# EAGLE design RH011.1 (EAGLE 7.1.0)
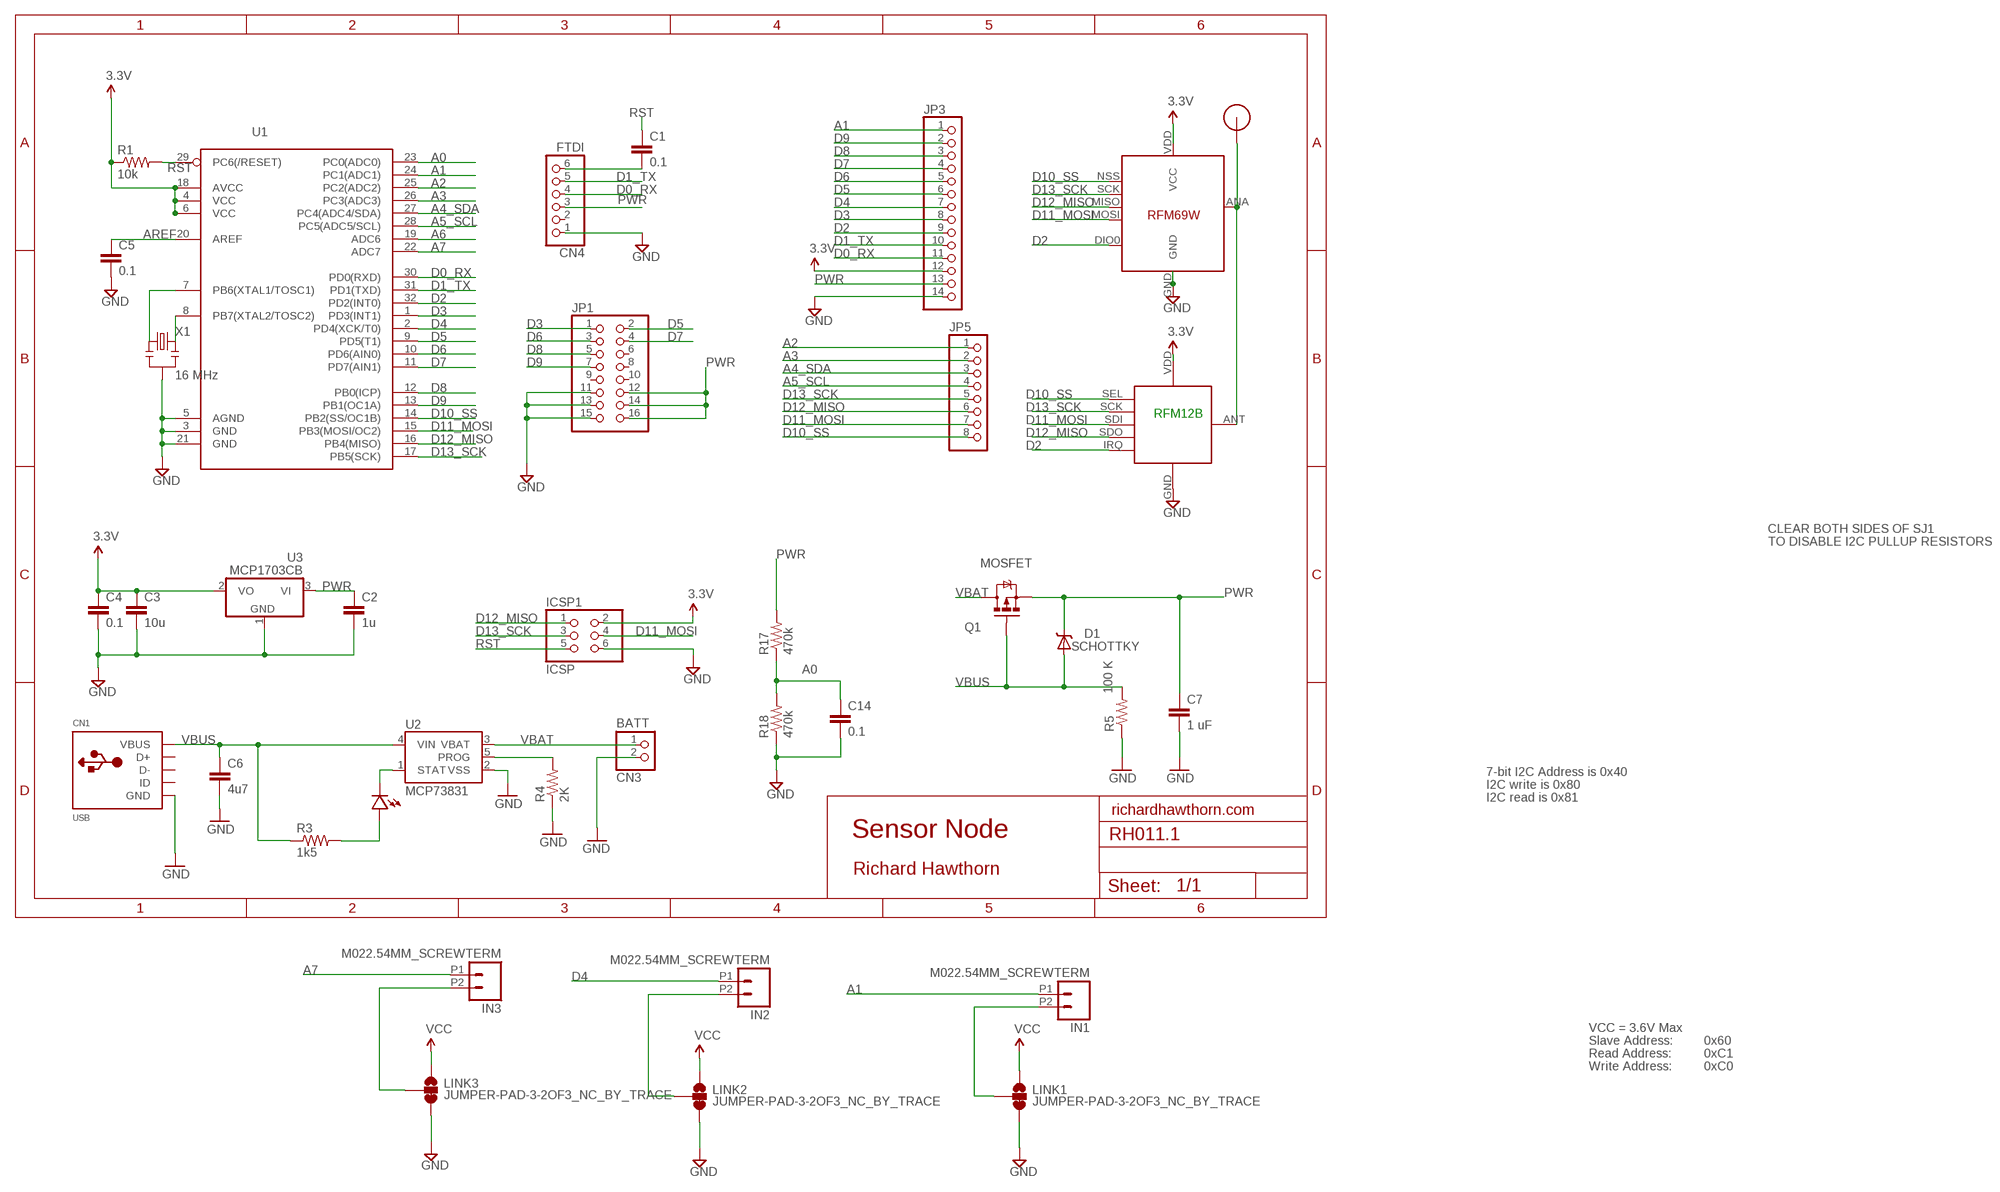
[diagram p0: schematic, sheet 1]

## Parts
C1  0.1  CAP0603-CAP  [0603-CAP]
C2  1u  CAP0603-CAP  [0603-CAP]
C3  10u  CAP0805-CAP  [0805-CAP]
C4  0.1  CAP0603-CAP  [0603-CAP]
C5  0.1  CAP0603-CAP  [0603-CAP]
C6  4u7  CAP0603-CAP  [0603-CAP]
C7  1 uF  CAP0805  [0805]
C14  0.1  CAP0603-CAP  [0603-CAP]
CN1  USB  USBMINIB  [USB-MINIB]
CN3  BATT  JST_2PIN-SMT-RA  [JST-PH-2-SMT-RA]
CN4  FTDI  PINHD-1X6  [1X06]
D1  SCHOTTKY  DIODE-SCHOTTKY_  [SMA-DIODE]
ICSP1  ICSP  PINHD-2X3  [2X03]
IN1  M022.54MM_SCREWTERM  [1X02_2.54_SCREWTERM]
IN2  M022.54MM_SCREWTERM  [1X02_2.54_SCREWTERM]
IN3  M022.54MM_SCREWTERM  [1X02_2.54_SCREWTERM]
JP1  PINHD-2X8  [2X08]
JP3  PINHD-1X14  [1X14]
JP5  PINHD-1X8  [1X08]
LED1  LED0603  [0603-LED]
LINK1  JUMPER-PAD-3-2OF3_NC_BY_TRACE  [PAD-JUMPER-3-2OF3_NC_BY_TRACE_YES_SILK_FULL_BOX]
LINK2  JUMPER-PAD-3-2OF3_NC_BY_TRACE  [PAD-JUMPER-3-2OF3_NC_BY_TRACE_YES_SILK_FULL_BOX]
LINK3  JUMPER-PAD-3-2OF3_NC_BY_TRACE  [PAD-JUMPER-3-2OF3_NC_BY_TRACE_YES_SILK_FULL_BOX]
Q1  MOSFET  MOSFET-PCHANNELSMD  [SOT23-3]
R1  10k  RESISTOR0603-RES  [0603-RES]
R3  1k5  RESISTOR0603-RES  [0603-RES]
R4  2K  RESISTOR0603-RES  [0603-RES]
R5  100 K  RESISTOR0805-RES  [0805]
R17  470k  RESISTOR0603-RES  [0603-RES]
R18  470k  RESISTOR0603-RES  [0603-RES]
RF1  RFM12B  RFM12B_MINPADS  [RFM12B-MINPADS]
RF2  RFM69  [RFM69W-MINPADS]
U1  ATMega-328  ATMEGA168/328TQFP32  [TQFP32-08]
U2  MCP73831  [SOT23-5]
U3  MCP1703CB  [SOT23]
U$1  RFM12B_ANTENNA  [RFM12B-ANTENNA]
X1  16 MHz  RESONATORSMD  [RESONATOR-SMD]

## Nets
3.3V: C3.1 C4.1 ICSP1.2 JP3.12 LINK1.1 LINK2.1 LINK3.1 R1.1 RF1.VDD RF2.VDD(VCC) U1.4(VCC) U1.6(VCC) U1.18(AVCC) U3.2(VO) ; supply symbol labelled VCC
A0: C14.1 R17.1 R18.2 U1.23(PC0(ADC0))
A1: IN1.P1 JP3.1 U1.24(PC1(ADC1))
A2: JP5.1 U1.25(PC2(ADC2))
A3: JP5.2 U1.26(PC3(ADC3))
A4_SDA: JP5.3 U1.27(PC4(ADC4/SDA))
A5_SCL: JP5.4 U1.28(PC5(ADC5/SCL))
A6: U1.19(ADC6)
A7: IN3.P1 U1.22(ADC7)
AREF: C5.1 U1.20(AREF)
D0_RX: CN4.4 JP3.11 U1.30(PD0(RXD))
D1_TX: CN4.5 JP3.10 U1.31(PD1(TXD))
D2: JP3.9 RF1.IRQ RF2.DIO0 U1.32(PD2(INT0))
D3: JP1.1 JP3.8 U1.1(PD3(INT1))
D4: IN2.P1 JP3.7 U1.2(PD4(XCK/T0))
D5: JP1.2 JP3.6 U1.9(PD5(T1))
D6: JP1.3 JP3.5 U1.10(PD6(AIN0))
D7: JP1.4 JP3.4 U1.11(PD7(AIN1))
D8: JP1.5 JP3.3 U1.12(PB0(ICP))
D9: JP1.7 JP3.2 U1.13(PB1(OC1A))
D10_SS: JP5.8 RF1.SEL RF2.NSS(SEL) U1.14(PB2(SS/OC1B))
D11_MOSI: ICSP1.4 JP5.7 RF1.SDI(SDI/MOSI) RF2.MOSI U1.15(PB3(MOSI/OC2))
D12_MISO: ICSP1.1 JP5.6 RF1.SDO(SDO/MISO) RF2.MISO U1.16(PB4(MISO))
D13_SCK: ICSP1.3 JP5.5 RF1.SCK RF2.SCK U1.17(PB5(SCK))
GND [power]: C2.2 C3.2 C4.2 C5.2 C6.2 C7.2 C14.2 CN1.GND CN3.2 CN4.1 ICSP1.6 JP1.11 JP1.13 JP1.15 JP3.14 LINK1.3 LINK2.3 LINK3.3 R4.1 R5.1 R18.1 RF1.GND RF2.GND U1.3(GND) U1.5(AGND) U1.21(GND) U2.2(VSS) U3.1(GND) X1.2
N$1: U1.7(PB6(XTAL1/TOSC1)) X1.1
N$3: RF1.ANT RF2.ANA(ANT) U$1.P$1
N$4: LED1.PLUS R3.2
N$13 [power]: IN1.P2 LINK1.2
N$15 [power]: IN2.P2 LINK2.2
N$19 [power]: IN3.P2 LINK3.2
N$20: C1.2 CN4.6
N$21: U1.8(PB7(XTAL2/TOSC2)) X1.3
PROG: R4.2 U2.5(PROG)
PWR [power]: C2.1 C7.1 CN4.3 D1.C JP1.12 JP1.14 JP1.16 JP3.13 Q1.2(S) R17.2 U3.3(VI)
RST: C1.1 ICSP1.5 R1.2 U1.29(PC6(/RESET))
STAT: LED1.MINUS U2.1(STAT)
VBAT: CN3.1 Q1.3(D) U2.3(VBAT)
VBUS [power]: C6.1 CN1.VBUS D1.A Q1.1(G) R3.1 R5.2 U2.4(VIN)
Unconnected: CN1.D+ CN1.D- CN1.ID CN4.2 JP1.6 JP1.8 JP1.9 JP1.10

## Notes on the sheet
- RFM12B
- CLEAR BOTH SIDES OF SJ1
- TO DISABLE I2C PULLUP RESISTORS
- 7-bit I2C Address is 0x40
- I2C write is 0x80
- I2C read is 0x81
- richardhawthorn.com
- Sensor Node
- Richard Hawthorn
- VCC = 3.6V Max
- Slave Address: | 0x60
- Read Address: | 0xC1
- Write Address: | 0xC0

## Library data of the parts
C1-C5 C14 = LowPowerLab:CAP: Capacitor Standard 0603 ceramic capacitor, and 0.1" leaded capacitor.
C6 = SparkFun:CAP: Capacitor Standard 0603 ceramic capacitor, and 0.1" leaded capacitor.
C7 = SparkFun-Capacitors:CAP: Capacitor Standard 0603 ceramic capacitor, and 0.1" leaded capacitor.
CN1 = LowPowerLab:USB: USB Connectors USBMINIB - Surface Mount Female Mini-B USB Connector 4UConnector: 06564 By microbuilder.eu Thru-hole RA Female Mini-B USB Connector 4UConnector: 18732 By ladyada.net
CN3 = adafruit:JST_2PIN: JST 2-Pin Connectors of various flavors SMT-RA (S2B-PH-SM4) 4UConnector #17311 SMT (B2B-PH-SM4) THM-RA (S2B-PH) THM (B2B-PH)
CN4 = pinhead:PINHD-1X6: PIN HEADER
D1 = SparkFun-DiscreteSemi:DIODE-SCHOTTKY: Commonly MBRA140.
ICSP1 = pinhead:PINHD-2X3: PIN HEADER
IN1-IN3 = SparkFun-Connectors:M02: Standard 2-pin 0.1" header. Use with - straight break away headers ( PRT-00116) - right angle break away headers (PRT-00553) - swiss pins (PRT-00743) - machine pins (PRT-00117) - female headers (PRT-00115) Molex polarized connector foot print use with: PRT-08233 with associated crimp pins and housings. 2.54_SCREWTERM for use with PRT-10571. 3.5mm Screw Terminal footprints for PRT-08084 5mm Screw Terminal footprints for use with PRT-08432
JP1 = pinhead:PINHD-2X8: PIN HEADER
JP3 = pinhead:PINHD-1X14: PIN HEADER
JP5 = pinhead:PINHD-1X8: PIN HEADER
LED1 = LowPowerLab:LED
LINK1-LINK3 = SparkFun-Passives:JUMPER-PAD-3-2OF3_NC_BY_TRACE
Q1 = SparkFun-DiscreteSemi:MOSFET-PCHANNEL: Generic PMOSFET
R1 R3 R4 R17 R18 = LowPowerLab:RESISTOR: Resistor Basic schematic elements and footprints for 0603, 1206, and PTH resistors.
R5 = SparkFun-Resistors:RESISTOR: Resistor Basic schematic elements and footprints for 0603, 1206, and PTH resistors.
RF1 = LowPowerLab:RFM12B_MINPADS
RF2 = LowPowerLab:RFM69
U1 = LowPowerLab:ATMEGA168/328: Atmel 32-pin 8-bit micro, 16k flash.
U2 = SparkFun:MCP73831: Microchip's MCP73831 Miniature single cell, fully integrated Li-Ion, Li-polymer charge management controller http://ww1.microchip.com/downloads/en/DeviceDoc/21984a.pdf
U3 = linear:MCP1703: 250 mA, 16V, Low Quiescent Current LDO Regulator Source: http://ww1.microchip.com/downloads/en/DeviceDoc/22049b.pdf
U$1 = LowPowerLab:RFM12B_ANTENNA
X1 = SparkFun:RESONATOR: Resonator Small SMD resonator. This is the itty bitty 10/20MHz resonators with built in caps. CSTCE10M0G55 and CSTCE20M0V53. Footprint has been reviewed closely but hasn't been tested yet.

## Net classes
1 power: width 0.381 mm, clearance 0.254 mm

## Board
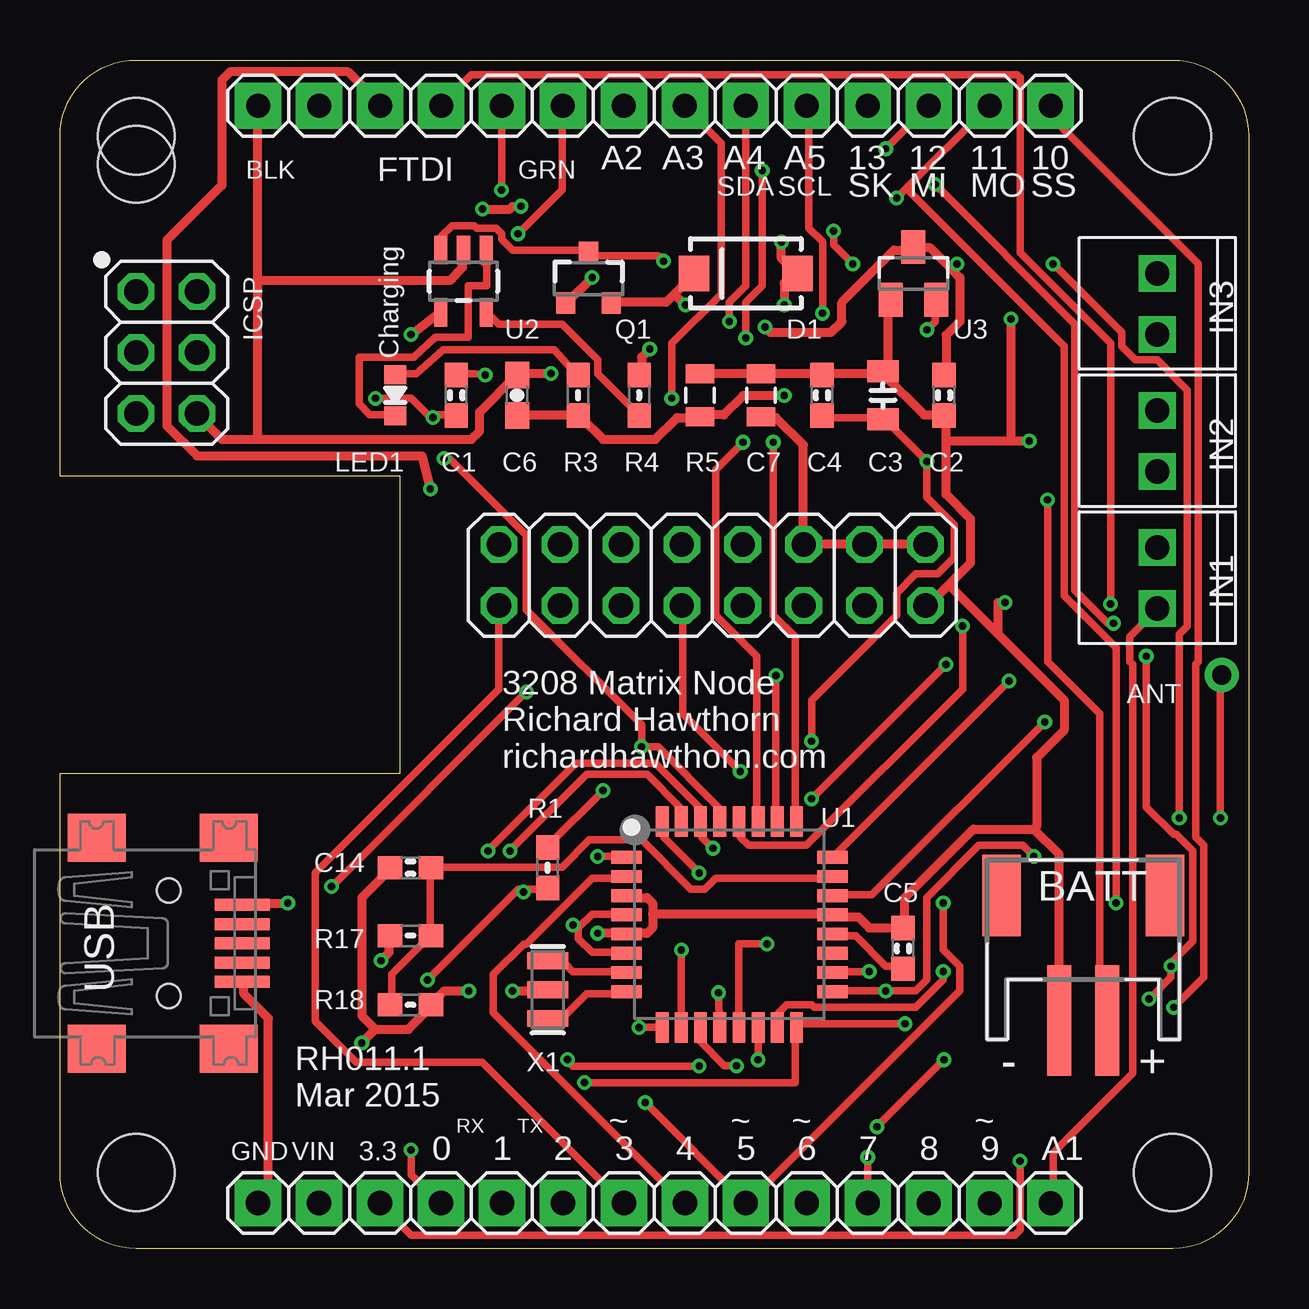
[diagram p1: board, top side]
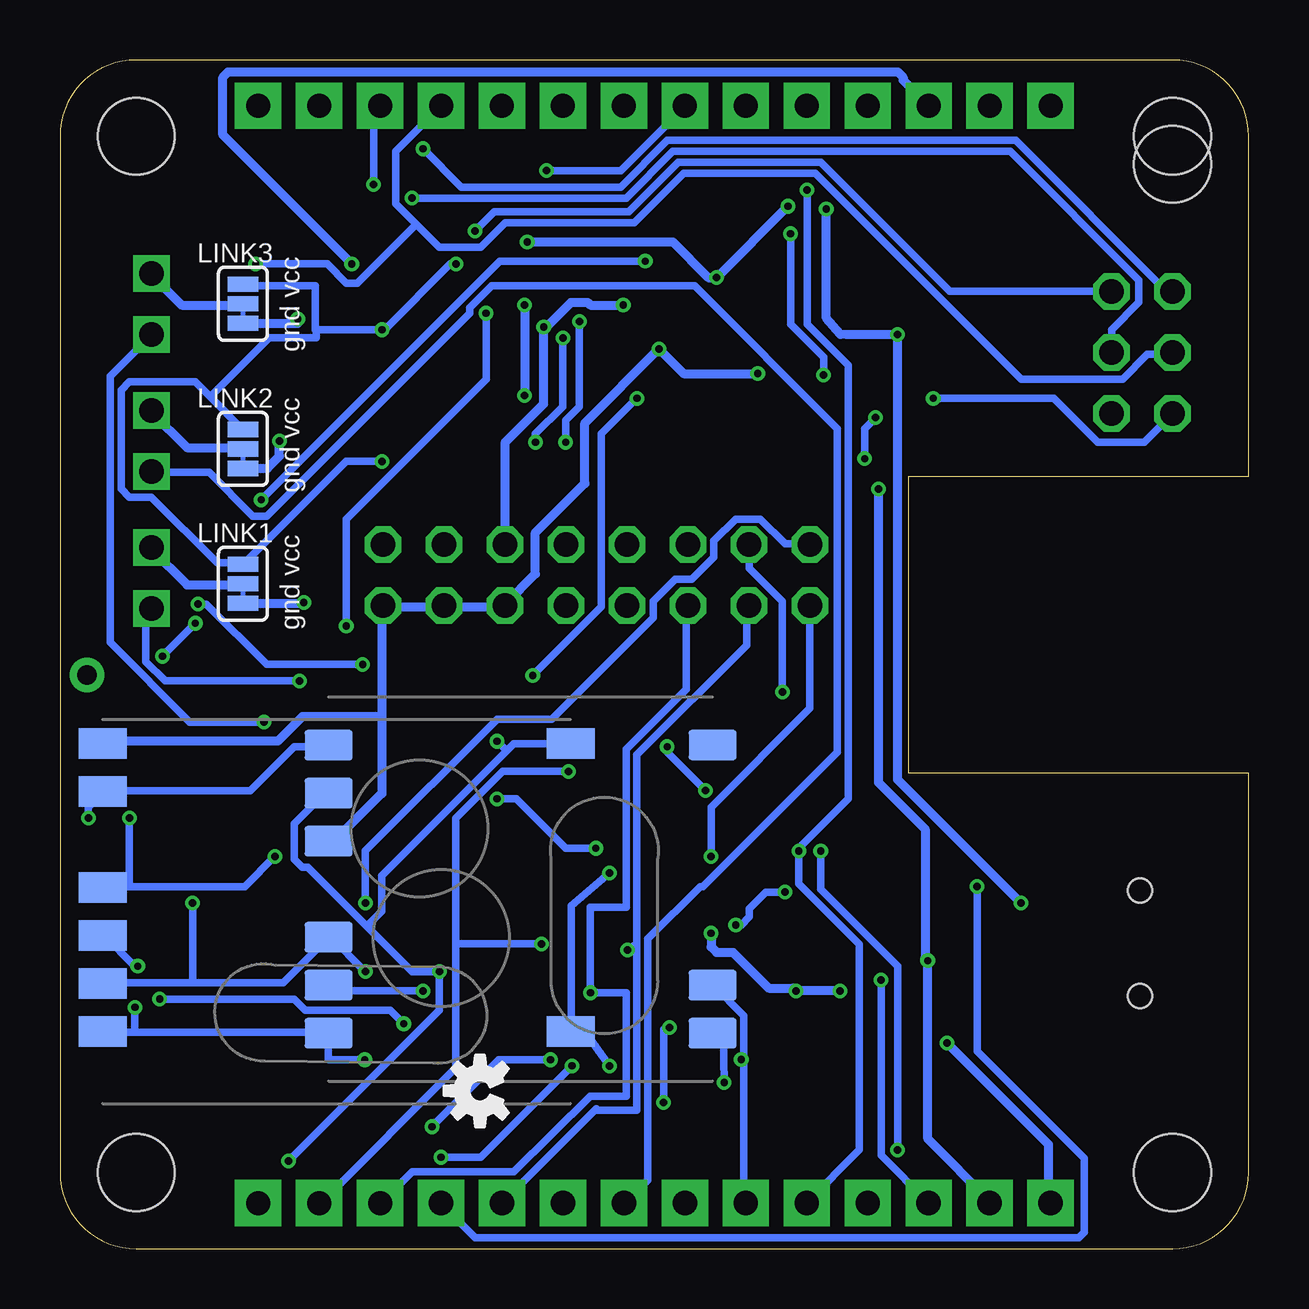
[diagram p2: board, bottom side, seen from below]

Size 49.53 x 49.53 mm. Coordinates in mm from the lower left corner, seen from the top.
Outline: 0,3.17 0,19.81 14.17,19.81 14.17,32.18 0,32.18 0,46.35 arc-90 3.17,49.53 46.35,49.53 arc-90 49.53,46.35 49.53,3.17 arc-90 46.35,0 3.17,0 arc-90 0,3.17
Copper layers (1*16): Top 0.035mm / dielectric 1.5mm / Bottom 0.035mm
Design rules "ITEADstudio_DRC *": minimum track width 12mil, minimum drill 12mil, track to track 6mil, track to pad 6mil, pad to pad 6mil, via to via 6mil, smd to smd 0mil, copper to edge 10mil, drill to drill 10mil, minimum pad ring 10mil, minimum via ring 6mil, stop-mask expansion 2mil, vias tented up to drill 100mil, thermal gap 15mil
Holes 3.2 mm at 3.17,3.17 46.35,3.17 3.17,46.35 46.35,46.35 3.17,45.19
tKeepout: area 0,0 to 5.7,5.7; area 43.8,0 to 49.5,5.7; area 43.8,43.8 to 49.5,49.5; area 0,43.8 to 5.7,49.5
bKeepout: area 0,43.8 to 5.7,49.5; area 43.8,43.8 to 49.5,49.5; area 43.8,0 to 49.5,5.7; area 0,0 to 5.7,5.7
tRestrict: area 24.3,8.9 to 29.1,12.8; area 5.8,16.9 to 6.9,18.5; area 5.2,9.7 to 6.7,10.4
bRestrict: area 27.4,17.7 to 29.2,18.7; area 21.1,13.8 to 22.9,14.9; area 21.6,12.6 to 22.1,13.2; area 20.7,12.6 to 21.2,13.2; area 20.2,12.8 to 20.7,13.5; area 20.1,13.4 to 20.6,14; area 26.5,18.9 to 27.1,19.5; area 26.5,17.9 to 27.1,18.5; area 27.5,19.1 to 28,19.8; area 27.9,18.8 to 29.1,19.6

### Footprints (pad centres in the part's own frame; a part is rotated, then mirrored left to right if it is on the bottom)
0603-CAP = smd 1.016 x 0.965: 1 -0.85,0; 2 0.85,0
0805-CAP = smd 0.902 x 1.3: 1 -1,0; 2 1,0
0603-CAP' = smd 1.1 x 1: 1 -0.85,0; 2 0.85,0
0805 = smd 0.8 x 1.2: 1 -0.9,0; 2 0.9,0
USB-MINIB = smd 0.5 x 2.308: D+ 0,4.064; D- -0.8,4.064; GND 1.6,4.064; ID 0.8,4.064; VBUS -1.6,4.064 | smd 2 x 2.4: GND1 -4.4,-2; GND2 -4.4,3.5; GND3 4.4,3.5; GND4 4.4,-2 | hole 1: -2.2,1; 2.2,1
JST-PH-2-SMT-RA = smd 1 x 4.6: 1 1,-3.7; 2 -1,-3.7 | smd 1.6 x 3.4: NC1 -3.4,1.5; NC2 3.4,1.5
1X06 = drill 1 pad 1.93 square: 1 -6.35,0; 2 -3.81,0; 3 -1.27,0; 4 1.27,0; 5 3.81,0; 6 6.35,0
SMA-DIODE = smd 1.27 x 1.47: A -2.15,0; C 2.15,0
2X03 = drill 1.016 octagon: 1 -2.54,-1.27; 2 -2.54,1.27; 3 0,-1.27; 4 0,1.27; 5 2.54,-1.27; 6 2.54,1.27
1X02_2.54_SCREWTERM = drill 1.016 square: P1 2.54,0; P2 0,0
2X08 = drill 1.016 octagon: 1 -8.89,-1.27; 2 -8.89,1.27; 3 -6.35,-1.27; 4 -6.35,1.27; 5 -3.81,-1.27; 6 -3.81,1.27; 7 -1.27,-1.27; 8 -1.27,1.27; 9 1.27,-1.27; 10 1.27,1.27; 11 3.81,-1.27; 12 3.81,1.27; 13 6.35,-1.27; 14 6.35,1.27; 15 8.89,-1.27; 16 8.89,1.27
1X14 = drill 1 pad 1.93 square: 1 -16.51,0; 2 -13.97,0; 3 -11.43,0 | drill 1.016 pad 1.93 square: 4 -8.89,0; 5 -6.35,0; 6 -3.81,0; 7 -1.27,0; 8 1.27,0; 9 3.81,0; 10 6.35,0; 11 8.89,0; 12 11.43,0; 13 13.97,0; 14 16.51,0
1X08 = drill 1 pad 1.93 square: 1 -8.89,0; 2 -6.35,0; 3 -3.81,0; 4 -1.27,0; 5 1.27,0; 6 3.81,0; 7 6.35,0; 8 8.89,0
0603-LED = smd 0.8 x 0.9: MINUS -0.85,0; PLUS 0.85,0
PAD-JUMPER-3-2OF3_NC_BY_TRACE_YES_SILK_FULL_BOX = smd 0.635 x 1.27: 1 -0.813,0; 2 0,0; 3 0.813,0
SOT23-3 = smd 0.8 x 0.9: 1 -0.95,-1; 2 0.95,-1; 3 0,1.1
0603-RES = smd 1.016 x 0.965: 1 -0.85,0; 2 0.85,0
RFM12B-MINPADS = smd 2 x 1.27: ANT 8,-6; GND 8,-2; IRQ -8,4; SCK 8,4; SDI 8,2; SDI1 -8.002,-6.001; SDO -8,6; SEL 8,6; VDD 8,-4
RFM69W-MINPADS = smd 2 x 1.27: ANA 8,-5; DIO0 -11.5,5; GND 8,-7; MISO 8,1; MOSI 8,3; NSS 8,5; SCK 8,-1; VDD -11.5,-7
TQFP32-08 = smd 1.27 x 0.533: 1 -4.293,2.8; 2 -4.293,2; 3 -4.293,1.2; 4 -4.293,0.4; 5 -4.293,-0.4; 6 -4.293,-1.2; 7 -4.293,-2; 8 -4.293,-2.8; 17 4.293,-2.8; 18 4.293,-2; 19 4.293,-1.2; 20 4.293,-0.4; 21 4.293,0.4; 22 4.293,1.2; 23 4.293,2; 24 4.293,2.8 | smd 0.533 x 1.27: 9 -2.8,-4.293; 10 -2,-4.293; 11 -1.2,-4.293; 12 -0.4,-4.293; 13 0.4,-4.293; 14 1.2,-4.293; 15 2,-4.293; 16 2.8,-4.293; 25 2.8,4.293; 26 2,4.293; 27 1.2,4.293; 28 0.4,4.293; 29 -0.4,4.293; 30 -1.2,4.293; 31 -2,4.293; 32 -2.8,4.293
SOT23-5 = smd 0.55 x 1.2: 1 -0.95,-1.3; 2 0,-1.3; 3 0.95,-1.3; 4 0.95,1.3; 5 -0.95,1.3
SOT23 = smd 1 x 1.4: 1 -0.95,-1.1; 2 0.95,-1.1; 3 0,1.1
RFM12B-ANTENNA = drill 0.8 pad 1.422: P$1 0,0
RESONATOR-SMD = smd 0.7 x 1.7: 1 -1.2,0; 2 0,0; 3 1.2,0

### Placement (x,y rotation side)
C1  16.51,35.56 90 top
C2  36.83,35.56 270 top
C3  34.29,35.56 90 top
C4  31.75,35.56 90 top
C5  35.13,12.52 90 top
C6  4u7  [0603-CAP']  19.05,35.56 90 top
C7  29.21,35.56 90 top
C14  14.61,15.88 180 top
CN1  3.53,12.73 270 top
CN3  42.64,13.22 0 top
CN4  14.61,47.62 0 top
D1  28.57,40.64 180 top
ICSP1  4.45,37.34 270 top
IN1  45.72,29.21 270 top
IN2  45.72,34.92 270 top
IN3  45.72,40.64 270 top
JP1  27.18,28.07 0 top
JP3  24.77,1.91 180 top
JP5  32.38,47.62 0 top
LED1  13.97,35.56 90 top
LINK1  41.91,27.71 270 bottom
LINK2  41.91,33.33 270 bottom
LINK3  41.91,39.37 270 bottom
Q1  22.02,40.41 0 top
R1  20.32,15.88 90 top
R3  21.59,35.56 90 top
R4  24.13,35.56 270 top
R5  26.67,35.56 270 top
R17  14.61,13.04 180 top
R18  14.61,10.16 180 top
RF1  30.34,14.99 180 bottom
RF2  39.75,14.05 180 bottom
U1  27.89,13.51 0 top
U2  16.81,40.31 180 top
U3  35.56,40.64 0 top
U$1  48.41,23.91 0 top
U$3  [OSHW-LOGO-S]  32.03,6.58 90 bottom
X1  20.32,10.79 270 top

### Tracks (layer width: path | path; a pad name or v marks a point on that pad's centre or on a via)
3.3V  (via drill 0.3)
  Top 0.305: 21.6,13.37 21.6,12.92 22.17,12.34 23.55,12.34 U1.6 | 21.6,13.37 22.17,13.95 23.55,13.95 U1.4 | 19.32,14.97 19.09,14.97 v15.32,11.2 | 19.32,14.97 20.23,14.97 R1.1 | v21.37,13.49 21.49,13.37 21.6,13.37 | v19.32,14.86 19.32,14.97 | v33.72,11.54 32.23,11.54 U1.18 | C4.1 31.77,34.63 34.29,34.63 C3.1 34.4,34.52 v36.12,32.8 36.12,31.32 37.26,30.18 37.26,28.8 36.58,28.12 35.66,28.12 34.86,27.32 34.86,26.4 31.32,22.86 v31.32,21.14 | v36.12,38.29 36.46,38.63 36.46,39.43 U3.2 | v32.23,42.41 32.23,41.83 v33.03,41.03 | v40.01,3.66 40.01,0.8 39.78,0.57 14.63,0.57 13.37,1.83 JP3.12
  Bottom 0.305: v15.32,11.2 15.32,3.89 JP3.12 | v21.37,13.49 21.14,13.49 20.8,13.83 20.8,14.17 20.12,14.86 v19.32,14.86 | 28.23,21.03 RF2.VDD 28.35,21.03 30.63,21.03 30.92,20.75 | 36.75,13.43 39.2,15.89 39.43,15.89 39.78,16.23 39.78,17.72 38.41,19.09 RF1.VDD | 36.75,13.43 34.86,11.54 v33.72,11.54 33.72,9.94 v40.01,3.66 | 30.92,20.75 36.12,15.54 36.12,14.06 36.75,13.43 | 43.26,35.49 41.95,34.18 LINK2.1 | 43.26,35.49 43.89,36.12 46.63,36.12 46.98,35.78 46.98,31.66 46.63,31.32 45.72,31.32 42.98,28.57 41.95,28.57 LINK1.1 41.83,28.57 37.6,32.8 v36.12,32.8 | 38.86,38.29 38.86,37.95 40.8,37.95 43.26,35.49 | 38.86,38.29 38.9,38.29 38.9,40.12 41.83,40.12 LINK3.1 | 38.86,38.29 v36.12,38.29 36.01,38.29 33.26,41.03 v33.03,41.03 | v32.23,42.41 31.43,43.2 25.83,43.2 23.77,45.26 17.83,45.26 12.46,39.89 ICSP1.2 | v31.32,21.14 30.92,20.75
A0
  Top 0.305: R18.2 13.83,10.17 13.83,11.43 15.43,13.03 R17.1 15.43,13.14 15.43,15.77 C14.1 15.54,15.89 20.92,15.89 22.06,17.03 24.23,17.03 26.29,14.97 26.86,14.97 27.32,15.43 32.12,15.43 U1.23
A1  (via drill 0.3)
  Top 0.305: v39.55,23.66 32.23,16.34 U1.24 | JP3.1 41.38,1.94 41.38,4 44.69,7.32 44.69,24.35 44.58,24.46 44.58,25.49 45.72,26.63 IN1.P1
  Bottom 0.305: v39.55,23.66 45.15,23.66 45.95,24.46 45.95,26.4 45.72,26.63 IN1.P1
A2  (via drill 0.3)
  Top 0.305: v29.72,33.6 29.72,26.4 30.63,25.49 30.63,17.83 U1.25 | v28.57,37.95 28.57,39.43 29.26,40.12 v29.26,44.92
  Bottom 0.305: v29.72,33.6 29.72,33.95 28.57,35.09 v28.57,37.95 | v29.26,44.92 26.18,44.92 23.55,47.55 JP5.1
A3  (via drill 0.3)
  Top 0.305: v29.83,23.89 29.83,17.83 U1.26 | v25.49,35.43 25.49,37.72 27.55,39.78 27.55,46.06 26.06,47.55 JP5.2
  Bottom 0.305: v29.83,23.89 26.98,26.75 26.98,33.95 v25.49,35.43
A4_SDA  (via drill 0.3)
  Top 0.305: v28.46,33.6 27.32,32.46 27.32,26.4 29.03,24.69 29.03,17.83 U1.27 | v27.89,38.63 27.89,39.43 28.57,40.12 JP5.3
  Bottom 0.305: v28.46,33.6 28.46,34.52 27.89,35.09 v27.89,38.63
A5_SCL  (via drill 0.3)
  Top 0.305: v37.6,25.95 37.6,23.32 31.09,16.8 28.69,16.8 28.35,17.14 28.35,17.72 U1.28 | v31.77,38.98 31.77,41.95 31.2,42.52 31.2,47.55 JP5.4
  Bottom 0.305: v37.6,25.95 37.6,30.4 31.77,36.23 v31.77,38.98
A7  (via drill 0.3)
  Top 0.305: v41.03,21.95 33.83,14.74 32.23,14.74 U1.22
  Bottom 0.305: v41.03,21.95 44.12,21.95 47.43,25.26 47.43,36.35 45.72,38.06 IN3.P1
AREF
  Top 0.305: C5.1 35.09,11.77 34.4,11.77 33.15,13.03 32.23,13.03 U1.20
D0_RX  (via drill 0.3)
  Top 0.305: v17.83,16.57 21.49,20.23 24.8,20.23 26.63,18.4 26.63,17.83 U1.30 26.75,17.72 26.75,17.14 v27.2,16.69 | v14.63,4.12 14.63,3.09 15.77,1.94 JP3.11 | v43.78,26.86 43.78,37.72 40.01,41.49 40.01,48.81 39.89,48.92 17.14,48.92 15.89,47.66 CN4.4 | v31.32,18.75 v36.92,24.35
  Bottom 0.305: v17.83,16.57 17.83,14.97 14.63,11.77 v14.63,4.12 | v43.78,26.86 43.43,26.86 40.92,24.35 v36.92,24.35 | v31.32,18.75 30.52,18.75 28.46,16.69 v27.2,16.69
D1_TX  (via drill 0.3)
  Top 0.305: v18.75,16.57 21.95,19.77 24.46,19.77 25.83,18.4 25.83,17.83 U1.31 | v18.4,44.12 18.4,47.55 CN4.5
  Bottom 0.305: JP3.10 18.4,1.94 16.23,4.12 16.23,12.69 18.75,15.2 v18.75,16.57 18.75,16.69 16.69,18.75 16.69,36.8 18.4,38.52 v18.4,44.12
D2  (via drill 0.3)
  Top 0.305: v26.63,15.66 25.15,17.14 25.15,17.72 U1.32 | v26.63,7.61 21.37,7.61 v21.14,7.89
  Bottom 0.305: v26.63,15.66 28.23,14.3 28.23,9.14 RF2.DIO0 27.89,9.37 v26.63,7.61 | 21.03,7.89 21.03,1.94 JP3.9 | 21.03,7.89 21.03,9.72 22.29,10.97 RF1.IRQ | v21.14,7.89 21.03,7.89
D3  (via drill 0.3)
  Top 0.305: v22.4,16.34 23.55,16.34 U1.1 | JP1.1 18.29,23.32 10.63,15.66 10.63,9.49 12.34,7.77 17.6,7.77 23.43,1.94 JP3.8
  Bottom 0.305: v22.4,16.34 22.4,18.4 18.29,22.52 JP1.1
D4
  Top 0.305: U1.2 23.55,15.43 22.17,15.43 19.43,12.69 19.32,12.69 18.06,11.43 18.06,9.83 25.95,1.94 JP3.7
  Bottom 0.305: IN2.P1 45.72,32.35 43.32,32.35 41.49,30.52 40.92,30.52 32.46,38.98 32.46,39.2 31.55,40.12 23.09,40.12 17.14,34.18 17.14,20.69 22.75,15.09 22.86,15.09 25.03,12.92 25.03,2.86 25.95,1.94 JP3.7
D5  (via drill 0.3)
  Top 0.305: v36.8,14.4 36.8,12.46 37.49,11.77 37.49,10.74 28.57,1.83 JP3.6 v24.38,6.1 | v24.13,9.22 U1.9
  Bottom 0.305: v36.8,14.4 36.8,16.57 31.32,22.06 29.03,22.06 24.8,26.29 24.8,26.98 23.89,27.89 23.2,27.89 22.29,28.8 22.29,29.49 21.37,30.4 20.34,30.4 19.32,29.38 18.29,29.38 JP1.2 | v24.38,6.1 24.38,9.14 v24.13,9.22
D6  (via drill 0.3)
  Top 0.305: U1.10 v25.89,12.45
  Bottom 0.305: 25.49,12.7 25.49,5.77 27.18,5.77 27.18,5.84 31.09,1.94 JP3.5 | 25.49,12.7 25.49,20.57 20.92,25.15 20.92,26.75 JP1.3 | v25.89,12.45 25.49,12.7
D7  (via drill 0.3)
  Top 0.305: v11.32,15.09 v19.43,23.2 | U1.11 26.67,8.64 27.69,7.62 v28.19,7.62 | v33.66,3.81 JP3.4
  Bottom 0.305: v19.43,23.2 19.43,26.98 20.8,28.35 20.8,29.26 JP1.4 | v11.32,15.09 11.32,8.23 6.86,3.77 6.86,0.69 7.09,0.46 32.23,0.46 33.6,1.83 JP3.4 | v28.19,7.62 32,3.81 v33.66,3.81
D8  (via drill 0.3)
  Top 0.305: U1.12 v27.43,10.67
  Bottom 0.305: JP1.5 23.43,26.75 23.43,23.32 25.95,20.8 25.95,14.22 27.43,14.22 v27.43,10.67 25.95,10.67 25.95,6.36 27.43,6.36 27.43,6.35 30.63,3.2 34.86,3.2 36.12,1.94 JP3.3
D9  (via drill 0.3)
  Top 0.305: v28.35,19.89 25.95,22.29 25.95,26.75 JP1.7 | U1.13 28.29,12.7 v29.46,12.7
  Bottom 0.305: v28.35,19.89 31.09,19.89 33.03,17.95 33.03,12.7 | 33.03,12.7 33.03,7.54 38.63,1.94 JP3.2 | v29.46,12.7 33.03,12.7
D10_SS  (via drill 0.3)
  Top 0.305: v46.41,10.06 47.66,11.32 47.66,16.8 47.32,17.14 47.32,24.35 47.43,24.46 47.43,41.03 41.38,47.09 41.38,47.55 JP5.8 | U1.14 v29.09,7.87 | v34.04,5.08 v36.83,7.87
  Bottom 0.305: 46.41,9.03 47.66,9.03 RF2.NSS | 46.41,9.03 38.41,9.03 RF1.SEL 38.35,7.87 v36.83,7.87 | 46.41,9.03 v46.41,10.06 | v29.09,7.87 31.24,7.87 v34.04,5.08
D11_MOSI  (via drill 0.3)
  Top 0.305: v36.8,11.54 36.8,11.2 35.66,10.06 31.43,10.06 31.32,10.17 30.29,10.17 29.95,9.83 29.95,9.26 U1.15 | 35.26,44.18 38.63,47.55 JP5.7 | 35.26,44.18 v34.86,43.78 | v44.01,14.4 44.01,25.03 41.83,27.2 41.83,37.6 35.26,44.18
  Bottom 0.305: v36.8,11.54 38.29,13.03 RF1.SDI 38.41,12.92 40.23,11.09 44.01,11.09 | 44.01,11.09 47.66,11.09 RF2.MOSI | ICSP1.4 5.71,38.29 4.57,39.43 4.57,40.35 9.94,45.72 24,45.72 25.95,43.78 v34.86,43.78 | v44.01,14.4 44.01,11.09
D12_MISO  (via drill 0.3)
  Top 0.305: v21.86,6.92 30.63,6.92 30.63,9.14 U1.16 30.75,9.26 30.86,9.37 v35.2,9.37 | v45.38,10.4 46.29,11.32 v46.29,11.77 46.29,11.89 47.21,12.8 47.21,16.57 46.52,17.26 46.41,17.26 45.26,18.4 v45.26,24.69 | JP5.6 v34.4,45.83 | v43.89,26.06 43.66,26.06 42.29,27.43 42.29,38.52 v36.46,44.35
  Bottom 0.305: v21.86,6.92 21.89,8.91 RF1.SDO | v46.29,11.77 46.41,11.77 47.66,13.03 RF2.MISO | v45.38,10.4 39.78,10.4 39.32,9.94 35.78,9.94 v35.2,9.37 | v34.4,45.83 32.8,44.23 26.18,44.23 24.23,46.18 9.72,46.18 3.43,39.89 3.2,39.89 ICSP1.1 | v43.89,26.06 v45.26,24.69 | v36.46,44.35 36.46,47.32 36.23,47.55 JP5.6
D13_SCK  (via drill 0.3)
  Top 0.305: U1.17 32.23,10.74 v34.4,10.74 35.66,10.74 36.12,11.2 36.12,14.63 38.29,16.8 40.12,16.8 v40.58,16.34 | v46.63,17.95 46.63,25.6 46.98,25.95 46.98,35.78 45.72,37.03 44.81,37.03 44.23,37.6 44.23,38.18 v41.38,41.03
  Bottom 0.305: v34.4,10.74 38.06,10.74 38.29,10.97 RF1.SCK | 46.63,15.09 41.83,15.09 v40.58,16.34 | 46.63,15.09 47.66,15.09 RF2.SCK | 34.69,42.69 35.55,43.55 35.55,45.72 33.72,47.55 JP5.5 | 34.69,42.69 33.72,41.72 32,41.72 30.98,42.75 25.6,42.75 23.55,44.81 18.06,44.81 9.49,36.23 5.26,36.23 4.23,37.26 3.2,37.26 ICSP1.3 | v46.63,17.95 46.63,15.09 | v41.38,41.03 38.41,41.03 37.6,40.23 37.15,40.23 34.69,42.69
GND  (via drill 0.3)
  Top 0.381: CN1.GND 7.66,11.09 7.66,10.63 8.69,9.6 8.69,2.29 8.34,1.94 JP3.14 | 13.14,9.14 14.52,9.14 15.43,10.06 R18.1 15.54,10.29 16,10.74 v17.03,10.74 | 13.14,9.14 12.57,9.72 12.57,14.63 13.72,15.77 C14.2 | v18.86,10.74 20.23,10.74 X1.2 | 24.69,13.95 24.69,14.4 24.46,14.63 23.66,14.63 U1.3 | 24.69,13.95 24.69,13.37 24.46,13.14 23.66,13.14 U1.5 23.43,13.14 v22.4,13.14 | 24.69,13.95 32,13.95 U1.21 32.23,13.83 33.26,13.83 33.72,13.37 35.09,13.37 C5.2 35.2,13.49 35.2,14.63 38.06,17.49 40.58,17.49 | 40.58,17.49 41.6,16.46 41.6,9.6 CN3.2 | 13.14,9.14 v12.57,8.57 | 8.23,33.72 6.74,33.72 5.71,34.75 ICSP1.6 | 8.23,33.72 17.14,33.72 17.49,34.06 17.49,34.86 18.97,36.35 C6.2 19.2,36.46 v20.46,36.46 | 8.23,33.72 8.23,40.34 | 8.23,40.34 8.23,47.55 CN4.1 | v24.57,37.49 24.23,37.15 24.23,36.46 R4.1 | R5.1 26.75,36.46 29.15,36.46 C7.2 29.38,36.46 31.66,36.46 C4.2 31.77,36.46 34.18,36.46 C3.2 | C3.2 34.29,36.46 36.01,34.75 36.8,34.75 C2.2 36.92,34.63 36.92,33.66 | U3.1 34.52,39.43 34.52,36.8 34.4,36.69 C3.2 | 36.92,33.66 36.92,31.43 37.95,30.4 37.95,28.57 37.03,27.66 | 37.03,27.66 36.12,26.75 JP1.15 | 37.03,27.66 39.08,25.62 | 39.08,25.62 41.83,22.86 41.83,21.6 40.69,20.46 40.69,17.6 40.58,17.49 | v40.39,33.66 39.62,33.66 | 39.62,33.66 36.92,33.66 | v39.62,38.73 39.62,33.66 | v39.37,26.92 39.08,26.92 39.08,25.62 | U2.2 16.76,41.61 16.76,40.89 16.26,40.34 8.23,40.34
  Bottom 0.381: v17.03,10.74 v18.86,10.74 18.97,10.86 20,10.86 21.49,12.34 22.17,12.34 22.4,12.57 v22.4,13.14 | v12.57,8.57 8.34,4.34 8.34,1.94 JP3.14 | 47.78,21.03 RF2.GND 47.66,21.14 40.46,21.14 39.43,22.17 36.12,22.17 | 36.12,22.17 36.12,26.75 JP1.15 35.89,26.75 33.6,26.75 JP1.13 33.38,26.75 31.09,26.75 JP1.11 30.98,26.86 29.72,28.12 29.72,29.83 27.66,31.89 27.66,34.4 v24.57,37.49 23.55,36.46 v20.46,36.46 | 36.12,22.17 36.12,18.97 38.06,17.03 38.29,17.03 RF1.GND | LINK2.3 41.15,32.51 40.89,32.51 40.39,33.02 v40.39,33.66 | LINK3.3 39.62,38.56 v39.62,38.73 | LINK1.3 39.37,26.9 v39.37,26.92
N$1
  Top 0.305: U1.7 23.55,11.54 21.37,11.54 21.03,11.89 20.34,11.89 X1.1
N$3  (via drill 0.3)
  Top 0.305: v48.35,17.95 48.35,23.89 U$1.P$1
  Bottom 0.305: RF1.ANT 38.41,20.92 39.78,20.92 41.6,19.09 47.66,19.09 RF2.ANA 47.78,18.97 48.35,18.4 v48.35,17.95
N$4
  Top 0.305: LED1.PLUS 14.06,36.46 14.83,36.46 15.98,37.47 20.6,37.47 21.49,36.46 R3.2
N$13
  Bottom 0.381: LINK1.2 41.95,27.66 44.23,27.66 45.72,29.15 IN1.P2
N$15
  Bottom 0.381: LINK2.2 41.95,33.38 44.23,33.38 45.72,34.86 IN2.P2
N$19
  Bottom 0.381: LINK3.2 41.95,39.32 44.46,39.32 45.72,40.58 IN3.P2
N$20  (via drill 0.3)
  Top 0.305: v17.72,36.41 17.26,36.46 16.57,36.46 C1.2 | v19.09,42.29 20.92,44.12 20.92,47.55 CN4.6
  Bottom 0.305: v17.72,36.41 17.72,37.15 19.09,38.52 v19.09,42.29
N$21
  Top 0.305: U1.8 23.55,10.63 21.95,10.63 20.92,9.6 20.34,9.6 X1.3
PROG
  Top 0.305: R4.2 24.12,34.75 22.4,36.46 22.4,37.03 20.92,38.52 18.29,38.52 17.83,38.98 U2.5
PWR  (via drill 0.3)
  Top 0.381: v13.37,12 13.72,12.34 13.72,13.03 R17.2 | 37.15,40.8 36.23,41.72 35.66,41.72 U3.3 35.43,41.6 34.75,41.6 32.58,39.43 32.58,38.63 32.12,38.18 29.6,38.18 v29.38,38.41 | 37.15,40.8 37.49,40.46 37.49,38.63 36.92,38.06 36.92,36.46 C2.1 | 25.6,39.78 26.4,40.58 D1.C | 25.6,39.78 25.26,39.43 22.97,39.43 Q1.2 | C7.1 29.26,34.63 29.83,34.63 30.98,33.49 30.98,29.38 JP1.12 31.09,29.38 33.49,29.38 JP1.14 33.6,29.38 36.01,29.38 JP1.16 | v26.06,39.32 25.6,39.78 | v37.38,41.03 37.15,40.8 | v15.43,31.66 15.07,33.03 5.71,33.03 4.46,34.29 4.46,42.02 6.74,44.31 6.74,48.69 7.09,49.03 12,49.03 13.37,47.66 CN4.3
  Bottom 0.381: JP3.13 10.74,1.94 13.37,4.57 v13.37,12 13.49,12.12 13.49,17.49 15.43,19.43 v15.43,31.66 | v26.06,39.32 27.43,39.32 27.55,39.43 28.23,39.43 29.32,38.35 | 29.32,38.35 29.38,38.29 29.38,35.2 30.98,33.6 30.98,29.38 JP1.12 | v29.38,38.41 29.32,38.35 | CN4.3 14.4,48.69 14.4,48.81 14.63,49.03 42.52,49.03 42.75,48.81 42.75,46.41 v37.38,41.03
RST  (via drill 0.3)
  Top 0.305: v22.63,19.09 20.34,16.8 R1.2 | U1.29 27.43,17.83 27.43,18.4 24.92,20.92 v24.23,20.92 24.23,21.83 19.43,26.63 19.43,29.72 16.23,32.92 v16,32.92 | 15.54,34.75 15.32,34.75 14.63,35.43 v13.14,35.43 | 15.54,34.75 16.46,34.75 C1.1 | v15.54,34.63 15.54,34.75
  Bottom 0.305: v22.63,19.09 24.23,20.69 v24.23,20.92 | v13.14,35.43 8.12,35.43 6.29,33.6 4.34,33.6 3.2,34.75 ICSP1.5 | v16,32.92 16,34.18 v15.54,34.63
STAT
  Top 0.305: LED1.MINUS 13.95,34.75 12.92,34.75 12.46,35.2 12.46,37.15 14.73,37.15 15.63,37.97 17,37.97 17.02,39.62 17.02,40.13 17.78,40.13 17.78,41.03 17.72,41.03 17.72,41.6 U2.1
VBAT  (via drill 0.3)
  Top 0.305: U2.3 15.89,41.72 15.89,42.18 16.34,42.63 17.26,42.63 17.37,42.52 18.17,42.52 18.4,42.29 18.4,42.06 18.86,41.6 21.95,41.6 Q1.3 22.06,41.38 24.92,41.38 v25.15,41.15 | v41.15,31.2 41.15,24.46 43.32,22.29 43.32,9.83 43.55,9.6 CN3.1
  Bottom 0.305: v25.15,41.15 31.2,41.15 v41.15,31.2
VBUS  (via drill 0.3)
  Top 0.381: C6.1 19.09,34.75 21.49,34.75 R3.1 21.72,34.63 22.63,33.72 24.8,33.72 25.72,34.63 26.63,34.63 R5.2 26.75,34.75 27.66,34.75 28.46,35.55 v30.18,35.55 | v22.17,40.46 21.14,39.43 Q1.1 | v30.06,41.95 30.06,41.26 30.63,40.69 D1.A 30.52,40.58 30.18,40.23 v30.18,39.32 | v14.63,38.09 15.77,38.98 U2.4 | v9.49,14.4 7.66,14.4 CN1.VBUS | v19.2,43.43 18.86,43.43 18.75,43.32 v17.6,43.32
  Bottom 0.381: v30.06,41.95 24,41.95 22.52,40.46 v22.17,40.46 v19.2,43.43 | v30.18,39.32 v30.18,35.55 | v9.49,14.4 14.63,19.55 v14.63,38.09 16.76,38.09 17.02,38.1 17.6,38.77 v17.6,43.32

### Text on the board
tNames: BLK | GRN | A2 | A3 | A4 | A5 | 13 | 12 | 11 | 10 | FTDI | SDA | SCL | SK | MI | MO | SS | IN3 | Charging | IN2 | IN1 | ANT | 3208 Matrix Node / Richard Hawthorn / richardhawthorn.com | RH011.1 / Mar 2015 | RX | TX | ~ | ~ | ~ | ~ | GND | VIN | 3.3 | 0 | 1 | 2 | 3 | 4 | 5 | 6 | 7 | 8 | 9 | A1
bNames: gnd vcc | gnd vcc | gnd vcc
tDocu: REG